# EAGLE design esp8266_v4_test (EAGLE 6.1)
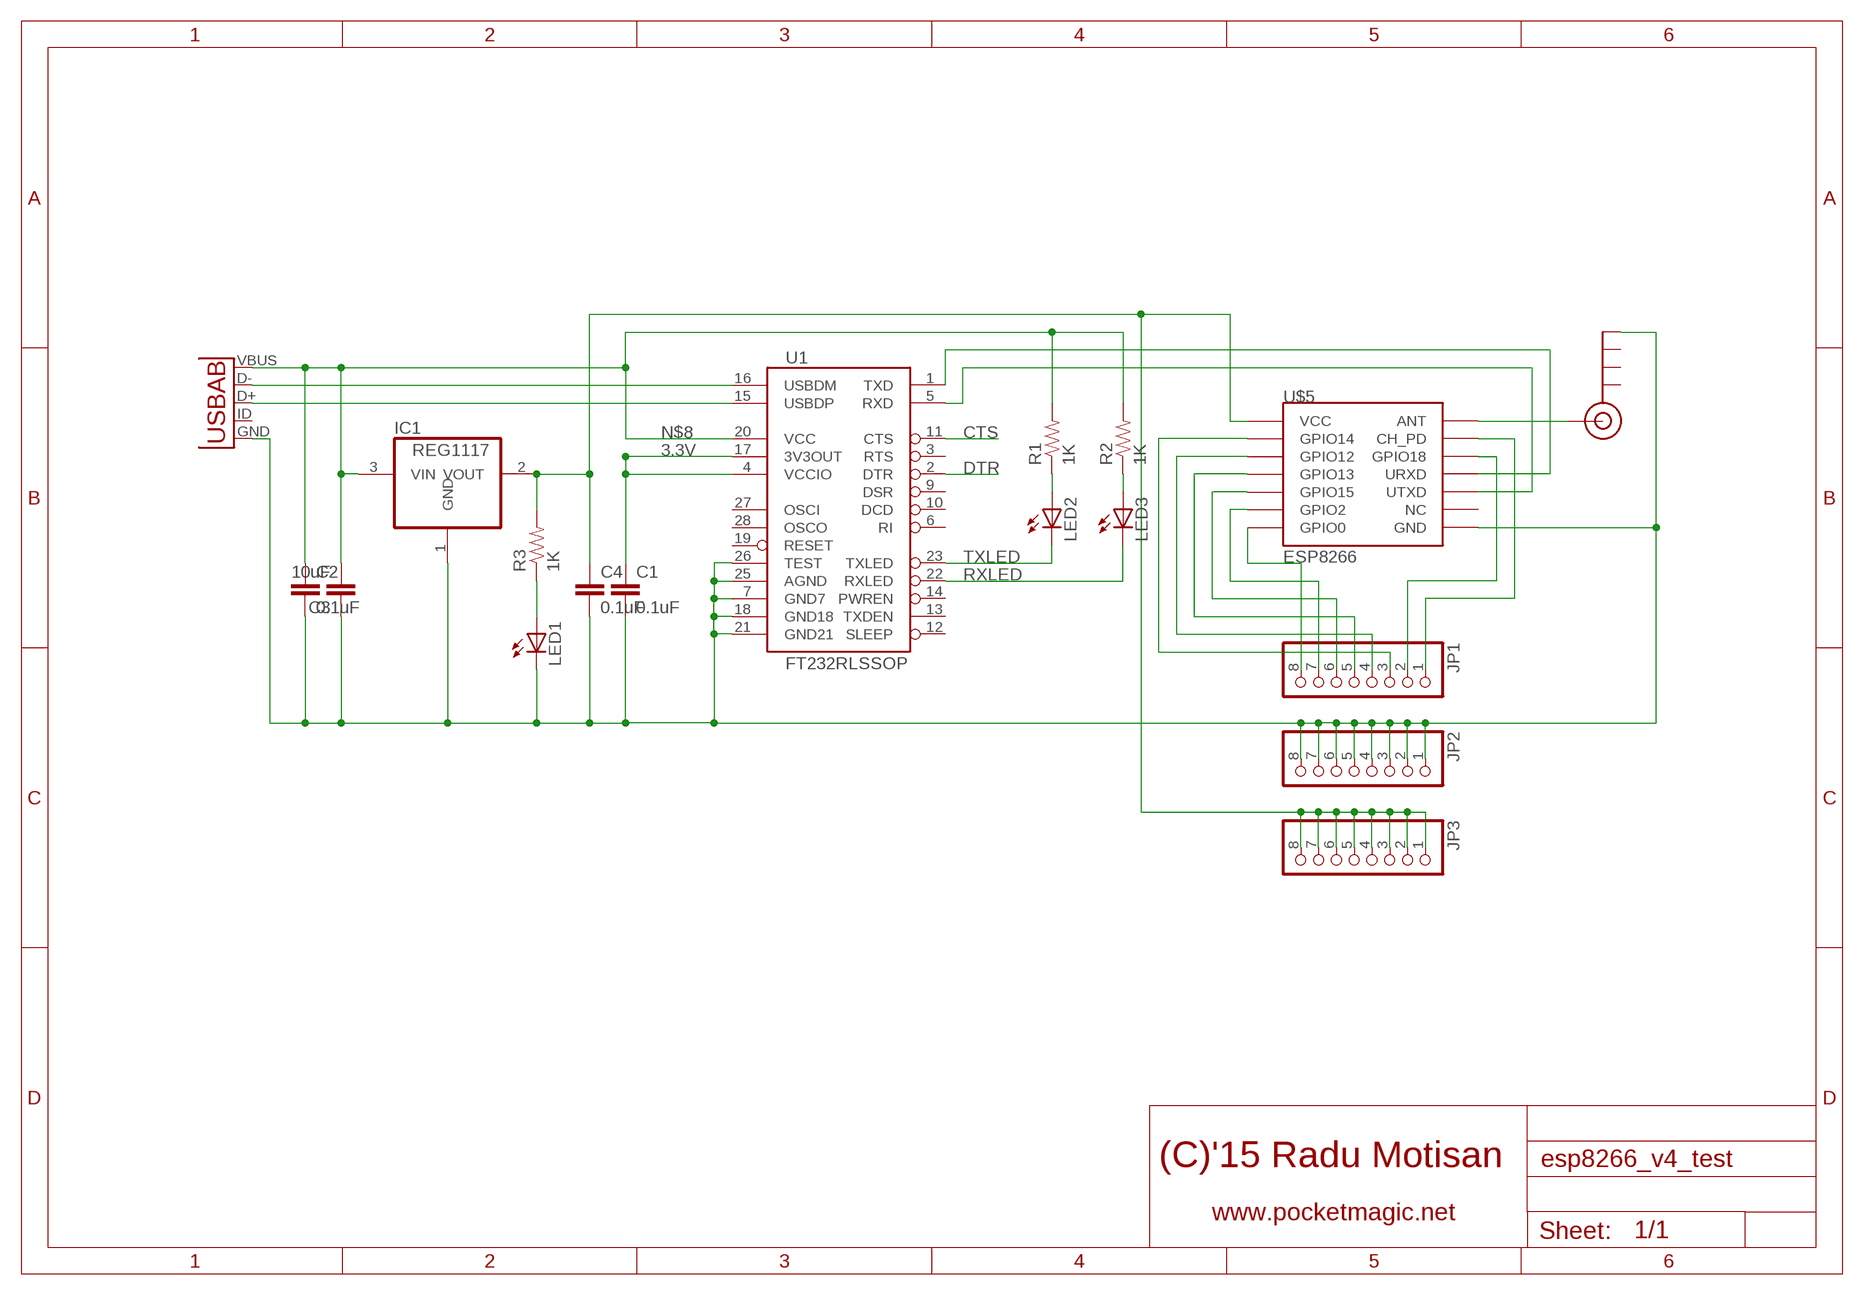
[diagram p0: schematic, sheet 1]

## Parts
C1  0.1uF  CAP0805  [0805]
C2  0.1uF  CAP0805  [0805]
C3  10uF  C-EUC0805K  [C0805K]
C4  0.1uF  CAP0805  [0805]
IC1  REG1117  [SOT223]
J$1  SMA_EDGE  [SMA-EDGE]
JP1  PINHD-1X8CLEANBIG  [1X08-CLEANBIG]
JP2  PINHD-1X8CLEANBIG  [1X08-CLEANBIG]
JP3  PINHD-1X8CLEANBIG  [1X08-CLEANBIG]
LED1  LEDCHIP-LED0805  [CHIP-LED0805]
LED2  LEDCHIP-LED0805  [CHIP-LED0805]
LED3  LEDCHIP-LED0805  [CHIP-LED0805]
R1  1K  RESISTOR0805-RES  [0805]
R2  1K  RESISTOR0805-RES  [0805]
R3  1K  RESISTOR0805-RES  [0805]
U1  FT232RLSSOP  [SSOP28DB]
U$2  USB_AB  [USB-AB-MICRO-SMD]
U$5  ESP8266  [ESP-03]

## Nets
3.3V [power]: C1.1 U1.4(VCCIO) U1.17(3V3OUT)
CTS: U1.11(CTS)
DTR: U1.2(DTR)
N$1: LED2.A R1.1
N$2: LED3.A R2.1
N$3: U1.16(USBDM) U$2.D-
N$4: U1.15(USBDP) U$2.D+
N$5: C4.1 IC1.2(VOUT) JP3.1 JP3.2 JP3.3 JP3.4 JP3.5 JP3.6 JP3.7 JP3.8 R3.2 U$5.VCC
N$6: J$1.SIG(SIGNAL) U$5.ANT
N$7: JP1.1 U$5.CH_PD
N$8: C2.1 C3.2 IC1.3(VIN) R1.2 R2.2 U1.20(VCC) U$2.VBUS
N$9: U1.1(TXD) U$5.URXD
N$10: U1.5(RXD) U$5.UTXD
N$11: JP1.2 U$5.GPIO18
N$12: JP1.8 U$5.GPIO0
N$13: JP1.7 U$5.GPIO2
N$14: JP1.6 U$5.GPIO15
N$15: JP1.5 U$5.GPIO13
N$16: JP1.4 U$5.GPIO12
N$17: JP1.3 U$5.GPIO14
N$45: LED1.A R3.1
N$GND [power]: C1.2 C2.2 C3.1 C4.2 IC1.1(GND) J$1.GND@3(GND) JP2.1 JP2.2 JP2.3 JP2.4 JP2.5 JP2.6 JP2.7 JP2.8 LED1.C U1.7(GND7) U1.18(GND18) U1.21(GND21) U1.25(AGND) U1.26(TEST) U$2.GND U$5.GND
RXLED: LED3.C U1.22(RXLED)
TXLED: LED2.C U1.23(TXLED)
Unconnected: J$1.GND@0(GND) J$1.GND@1(GND) J$1.GND@2(GND) U1.3(RTS) U1.6(RI) U1.9(DSR) U1.10(DCD) U1.12(SLEEP) U1.13(TXDEN) U1.14(PWREN) U1.19(RESET) U1.27(OSCI) U1.28(OSCO) U$2.ID(USBID) U$5.NC

## Notes on the sheet
- (C)'15 Radu Motisan
- www.pocketmagic.net

## Library data of the parts
C1 C2 C4 = SparkFun:CAP: Capacitor Standard 0603 ceramic capacitor, and 0.1" leaded capacitor.
C3 = rcl:C-EU: CAPACITOR, European symbol
IC1 = burr-brown:REG1117: 800mA and 1A Low Dropout (LDO) Positive Regulator 1.8V, 2.5V, 2.85V, 3.3V, 5V, and Adj; MPN: REG1117; OC_FARNELL: 1097566; OC_NEWARK: 14P6981
J$1 = sparkfun-connectors:SMA_EDGE: SMA Antenna Connector End launch SMA connector. The paste layer has been removed so that the connector can be hand soldered onto the board after reflow.
JP1-JP3 = adafruit:PINHD-1X8: PIN HEADER
LED1-LED3 = adafruit:LED: LED OSRAM: - CHIPLED LG R971, LG N971, LY N971, LG Q971, LY Q971, LO R971, LY R971 LH N974, LH R974 LS Q976, LO Q976, LY Q976 LO Q996 - Hyper CHIPLED LW Q18S LB Q993, LB Q99A, LB R99A - SideLED LS A670, LO A670, LY A670, LG A670, LP A670 LB A673, LV A673, LT A673, LW A673 LH A674 LY A675 LS A676, LA A676, LO A676, LY A676, LW A676 LS A679, LY A679, LG A679 - Hyper Micro SIDELED® LS Y876, LA Y876, LO Y876, LY Y876 LT Y87S - SmartLED LW L88C, LW L88S LB L89C, LB L89S, LG L890 LS L89K, LO L89K, LY L89K LS L896, LA L896, LO L896, LY L896 - TOPLED LS T670, LO T670, LY T670, LG T670, LP T670 LSG T670, LSP T670, LSY T670, LOP T670, LYG T670 LG T671, LOG T671, LSG T671 LB T673, LV T673, LT T673, LW T673 LH T674 LS T676, LA T676, LO T676, LY T676, LB T676, LH T676, LSB T676, LW T676 LB T67C, LV T67C, LT T67C, LS T67K, LO T67K, LY T67K, LW E67C LS E67B, LA E67B, LO E67B, LY E67B, LB E67C, LV E67C, LT E67C LW T67C LS T679, LY T679, LG T679 LS T770, LO T770, LY T770, LG T770, LP T770 LB T773, LV T773, LT T773, LW T773 LH T774 LS E675, LA E675, LY E675, LS T675 LS T776, LA T776, LO T776, LY T776, LB T776 LHGB T686 LT T68C, LB T68C - Hyper Mini TOPLED® LB M676 - Mini TOPLED Santana® LG M470 LS M47K, LO M47K, LY M47K Source: http://www.osram.convergy.de/
R1-R3 = SparkFun:RESISTOR: Resistor Basic schematic elements and footprints for 0603, 1206, and PTH resistors.
U1 = SparkFun:FT232RL: USB UART FT232RL 4th Generation USB UART (USB <-> Serial) Controller. Spark Fun Electronics SKU : COM-00650
U$2 = sparkfun-connectors:USB_AB: This is a USB AB connector that is compatible with USB OTG. i.e. this connector can serve as a host or device
U$5 = esp8266modules:ESP8266: ESP8266 Wifi module 03 & 04

## Net classes
0 default: width 0.203 mm
1 power: width 0.254 mm

## Board
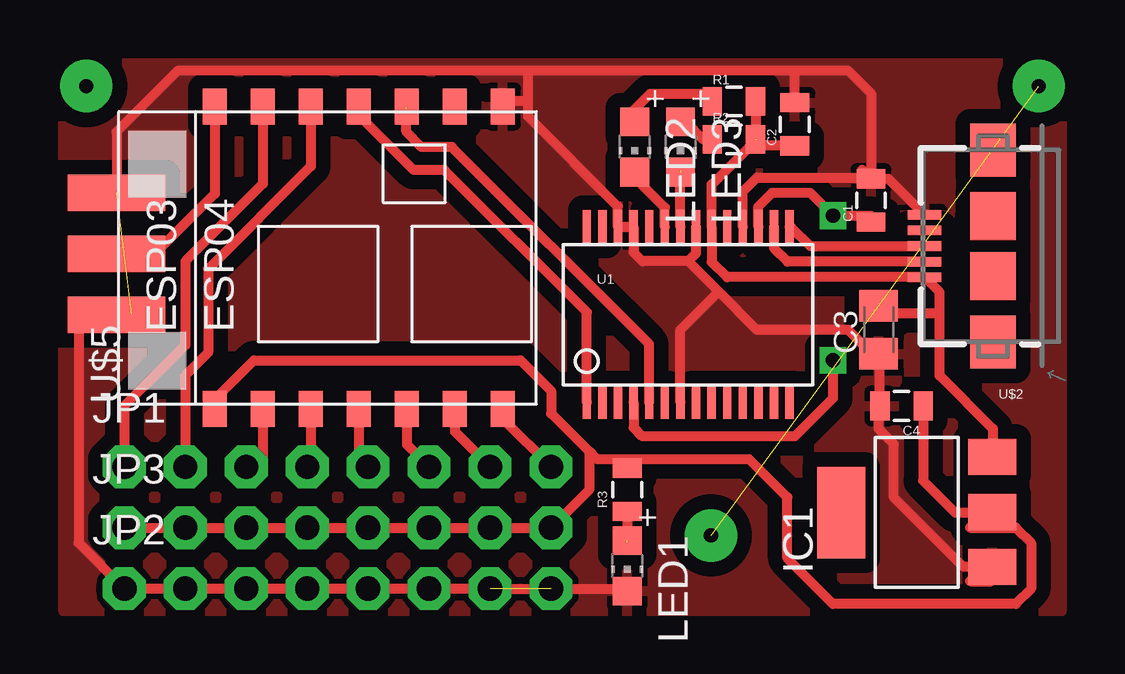
[diagram p1: board, top side]
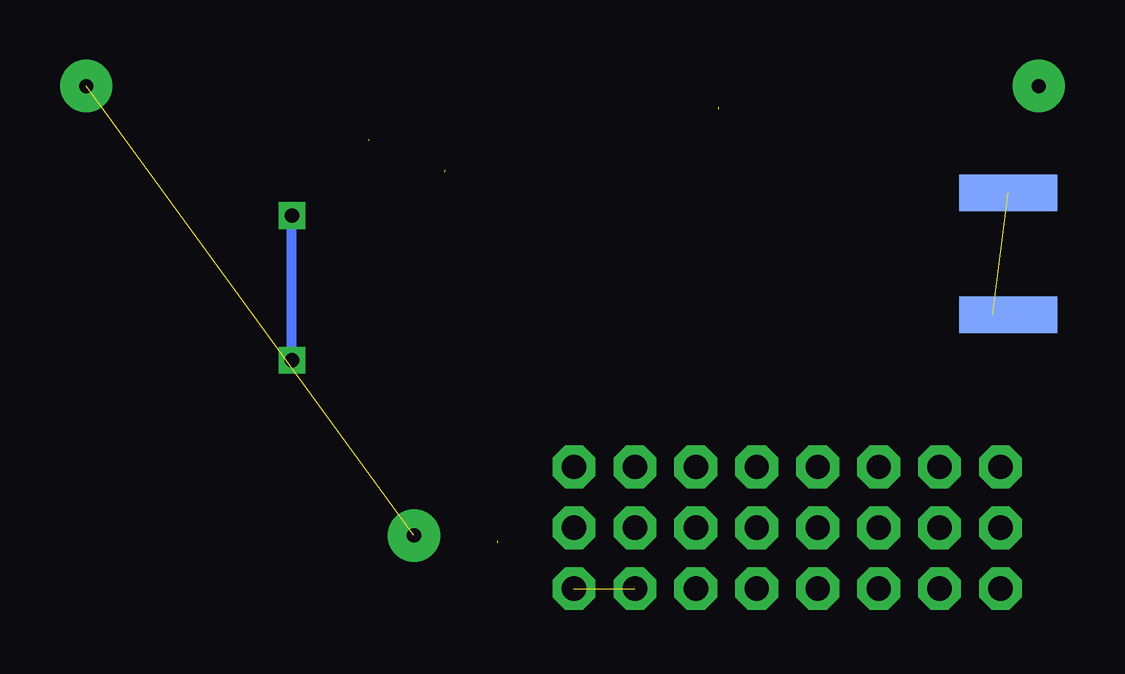
[diagram p2: board, bottom side, seen from below]

No outline drawn. Coordinates in mm, seen from the top.
Copper layers (1*16): Top 0.035mm / dielectric 1.5mm / Bottom 0.035mm
Design rules: minimum track width 8mil, minimum drill 20mil, track to track 8mil, track to pad 8mil, pad to pad 8mil, via to via 8mil, smd to smd 8mil, copper to edge 8mil, drill to drill 8mil, minimum pad ring 12mil, minimum via ring 10mil, stop-mask expansion 4mil, vias tented up to drill 20mil, thermal gap 10mil

### Footprints (pad centres in the part's own frame; a part is rotated, then mirrored left to right if it is on the bottom)
0805 = smd 0.8 x 1.2: 1 -0.9,0; 2 0.9,0
C0805K = smd 1.3 x 1.6: 1 -1,0; 2 1,0
SOT223 = smd 1.499 x 2.007: 1 -2.261,-3.15; 2 0.025,-3.15; 3 2.311,-3.15 | smd 3.81 x 2.007: 4 0,3.15
SMA-EDGE = smd 1.524 x 4.064: GND@0 0,0; GND@1 5.08,0; SIG 2.54,0 | smd 1.524 x 4.064 bottom: GND@2 0,0; GND@3 5.08,0
1X08-CLEANBIG = drill 1.016 pad 1.778 octagon: 1 -8.89,0; 2 -6.35,0; 3 -3.81,0; 4 -1.27,0; 5 1.27,0; 6 3.81,0; 7 6.35,0; 8 8.89,0
CHIP-LED0805 = smd 1.2 x 1.2: A 0,-1.05; C 0,1.05
SSOP28DB = smd 0.348 x 1.397: 1 -4.225,-3.656; 2 -3.575,-3.656; 3 -2.925,-3.656; 4 -2.275,-3.656; 5 -1.625,-3.656; 6 -0.975,-3.656; 7 -0.325,-3.656; 8 0.325,-3.656; 9 0.975,-3.656; 10 1.625,-3.656; 11 2.275,-3.656; 12 2.925,-3.656; 13 3.575,-3.656; 14 4.225,-3.656; 15 4.225,3.656; 16 3.575,3.656; 17 2.925,3.656; 18 2.275,3.656; 19 1.625,3.656; 20 0.975,3.656; 21 0.325,3.656; 22 -0.325,3.656; 23 -0.975,3.656; 24 -1.625,3.656; 25 -2.275,3.656; 26 -2.925,3.656; 27 -3.575,3.656; 28 -4.225,3.656
USB-AB-MICRO-SMD = smd 1.4 x 0.4: D+ 2.85,0; D- 2.85,0.65; GND 2.85,-1.3; ID 2.85,-0.65; VBUS 2.85,1.3 | smd 1.9 x 2: P$6 0,1.25; P$7 0,-1.25 | smd 1.9 x 2.2: P$8 0,4; P$9 0,-4
ESP-03 = smd 1.5 x 1: ANT 7.4,4.8; CH_PD 7.4,2.8; GND 7.4,-7.2; GPIO0 -5.2,-7.2; GPIO2 -5.2,-5.2; GPIO12 -5.2,0.8; GPIO13 -5.2,-1.2; GPIO14 -5.2,2.8; GPIO15 -5.2,-3.2; GPIO18 7.4,0.8; NC 7.4,-5.2; URXD 7.4,-1.2; UTXD 7.4,-3.2; VCC -5.2,4.8

### Placement (x,y rotation side)
C1  18.1,12.7 90 top
C2  14.92,15.88 90 top
C3  18.41,7.3 90 top
C4  19.37,4.13 180 top
IC1  20,-0.32 90 top
J$1  -13.34,7.94 90 top
JP1  -4.13,1.59 0 top
JP2  -4.13,-3.49 0 top
JP3  -4.13,-0.95 0 top
LED1  7.94,-2.54 180 top
LED2  8.26,14.92 180 top
LED3  10.16,14.92 180 top
R1  12.38,16.83 0 top
R2  12.38,15.24 0 top
R3  7.94,0.64 90 top
U1  10.48,7.94 0 top
U$2  23.18,10.79 180 top
U$5  -4.45,9.21 90 top

### Tracks (layer width: path | path; a pad name or v marks a point on that pad's centre or on a via)
3.3V  (via drill 0.6)
  Top 0.406: U1.17 13.4,12.45 13.97,13.02 15.56,13.02 v16.51,12.06 18.1,12.06 C1.1 | U1.4 8.2,3.23 8.57,2.86 14.92,2.86 16.51,4.45 v16.51,6.03
  Bottom 0.406: v16.51,6.03 v16.51,12.06
N$1
  Top 0.406: LED2.A 8.26,16.51 8.89,17.14 11.48,17.14 R1.1
N$2
  Top 0.406: LED3.A 10.38,15.97 11.11,15.24 R2.1
N$3
  Top 0.406: U1.16 14.05,10.71 14.62,10.14 U$2.D-
N$4
  Top 0.406: U1.15 14.76,11.59 15.56,10.79 U$2.D+
N$5
  Top 0.406: U$5.VCC -9.24,4.41 -7.62,6.03 3.49,6.03 4.76,4.76 4.76,3.81 6.35,2.22 | 22.23,-0.95 23.13,-0.95 | 23.13,-0.95 IC1.2 23.13,-0.32 21.59,-0.32 20.27,1 C4.1 | 23.13,-0.95 24.13,-0.95 24.77,-1.59 24.77,-3.49 24.13,-4.13 16.51,-4.13 14.61,-2.22 14.61,0.32 13.02,1.91 7.94,1.91 | JP3.1 JP3.2 JP3.3 JP3.4 JP3.5 JP3.6 JP3.7 JP3.8 6.35,0.64 6.35,2.22 | 7.94,1.91 6.67,1.91 6.35,2.22 | R3.2 7.94,1.91
N$6
  Top 0.406: U$5.ANT -9.24,12.98 -11.75,10.48 J$1.SIG
N$7
  Top 0.406: U$5.CH_PD -7.25,13.39 -10.48,10.16 -10.48,6.67 -13.02,4.13 JP1.1
N$8  (1 unrouted)
  Top 0.406: 20.95,7.94 20.95,5.4 23.18,3.17 23.18,1.97 | 20.95,7.94 20.95,8.87 U$2.VBUS 12.1,9.49 11.45,10.14 U1.20 11.45,13.36 13.34,15.24 | 20.95,7.94 20.91,7.99 18.73,7.99 C3.2 | 23.18,1.59 23.18,1.97 | 23.18,1.97 IC1.3 | R1.2 R2.2 13.55,14.97 C2.1
N$9
  Top 0.406: U$5.URXD -3.25,16.26 -0.95,13.97 0.32,13.97 6.25,8.04 U1.1
N$10  (1 unrouted)
  Top 0.406: U1.5 8.85,6.71 0.64,14.92 -0.64,14.92 -1.27,15.56 -1.27,16.51 | -1.27,16.58 U$5.UTXD
N$11
  Top 0.406: U$5.GPIO18 -5.25,14.12 -9.53,9.84 -9.53,6.35 -10.48,5.4 JP1.2
N$12
  Top 0.406: U$5.GPIO0 2.75,3.6 JP1.8
N$13
  Top 0.406: U$5.GPIO2 0.76,3.06 JP1.7
N$14
  Top 0.406: U$5.GPIO15 -1.25,2.52 JP1.6
N$15
  Top 0.406: U$5.GPIO13 -3.25,1.66 JP1.5
N$16
  Top 0.406: U$5.GPIO12 -5.25,1.42 JP1.4
N$17
  Top 0.406: U$5.GPIO14 -7.25,1.96 JP1.3
N$18  (via drill 0.6)
  other vias: -13.02,1.59
N$19  (via drill 0.6)
  other vias: -10.48,1.59
N$20  (via drill 0.6)
  other vias: -7.94,1.59
N$21  (via drill 0.6)
  other vias: -5.4,1.59
N$22  (via drill 0.6)
  other vias: -2.86,1.59
N$23  (via drill 0.6)
  other vias: -0.32,1.59
N$24  (via drill 0.6)
  other vias: 2.22,1.59
N$25  (via drill 0.6)
  other vias: 4.76,1.59
N$26  (via drill 0.6)
  other vias: 4.76,-0.95
N$27  (via drill 0.6)
  other vias: 2.22,-0.95
N$28  (via drill 0.6)
  other vias: -0.32,-0.95
N$29  (via drill 0.6)
  other vias: -2.86,-0.95
N$30  (via drill 0.6)
  other vias: -5.4,-0.95
N$31  (via drill 0.6)
  other vias: -7.94,-0.95
N$32  (via drill 0.6)
  other vias: -10.48,-0.95
N$33  (via drill 0.6)
  other vias: -13.02,-0.95
N$34  (via drill 0.6)
  other vias: -13.02,-3.49
N$35  (via drill 0.6)
  other vias: -10.48,-3.49
N$36  (via drill 0.6)
  other vias: -7.94,-3.49
N$37  (via drill 0.6)
  other vias: -5.4,-3.49
N$38  (via drill 0.6)
  other vias: -2.86,-3.49
N$39  (via drill 0.6)
  other vias: -0.32,-3.49
N$40  (via drill 0.6)
  other vias: 2.22,-3.49
N$41  (via drill 0.6)
  other vias: 4.76,-3.49
N$42  (via drill 0.6 pad 2.18)  (1 unrouted)
  other vias: 25.08,17.46 11.43,-1.27
N$43  (via drill 0.6 pad 2.18)
  other vias: -14.61,17.46
N$45  (1 unrouted)
  Top 0.406: R3.1 7.94,-1.59
N$GND  (3 unrouted)
  Top 0.406: U1.21 10.8,10.48 10.48,10.16 | 10.48,10.16 8.57,10.16 8.2,10.53 U1.25 U1.26 7.55,12.45 3.81,16.19 3.81,16.83 | 14.92,18.1 17.14,18.1 18.1,17.14 18.1,13.65 | 14.92,18.1 3.81,18.1 | 3.81,18.1 -10.79,18.1 -13.34,15.56 J$1.GND@3 | 10.48,10.16 11.75,8.89 | 19,6.03 C3.1 18.47,6.25 C4.2 18.41,4.08 18.41,3.17 19.05,2.54 19.05,0.32 21.95,-2.58 IC1.1 23.11,-3.17 22.23,-3.17 | U1.7 10.15,7.29 11.75,8.89 | 19.97,12.1 U$2.GND 18.82,13.6 C1.2 | -12.7,7.94 -14.92,7.94 -14.92,-1.59 JP2.1 | JP2.1 JP2.2 JP2.3 JP2.4 JP2.5 JP2.6 JP2.7 7.62,-3.49 | JP2.1 -13.34,-3.49 | 18.73,6.03 18.41,6.03 17.14,7.3 13.34,7.3 11.75,8.89 | 7.62,-3.49 7.94,-3.49 | LED1.C 7.72,-3.59 7.62,-3.49 | 17.73,13.97 C1.2 | 3.81,16.83 3.81,18.1 | 3.81,16.83 2.98,16.83 U$5.GND | U1.18 12.75,13.07 13.34,13.65 18.05,13.65 C1.2 | C2.2 14.92,18.1
  pour Top (isolate 0.61): -15.56,18.41 26.04,18.41 26.04,-4.45 -15.56,-4.45
RXLED  (1 unrouted)
  Top 0.406: U1.22 10.15,13.96 10.16,13.97
TXLED
  Top 0.406: U1.23 9.5,12.4 8.57,13.34 8.57,13.55 LED2.C